# EAGLE board MotorBoard (EAGLE 6.4), part 1 of 2
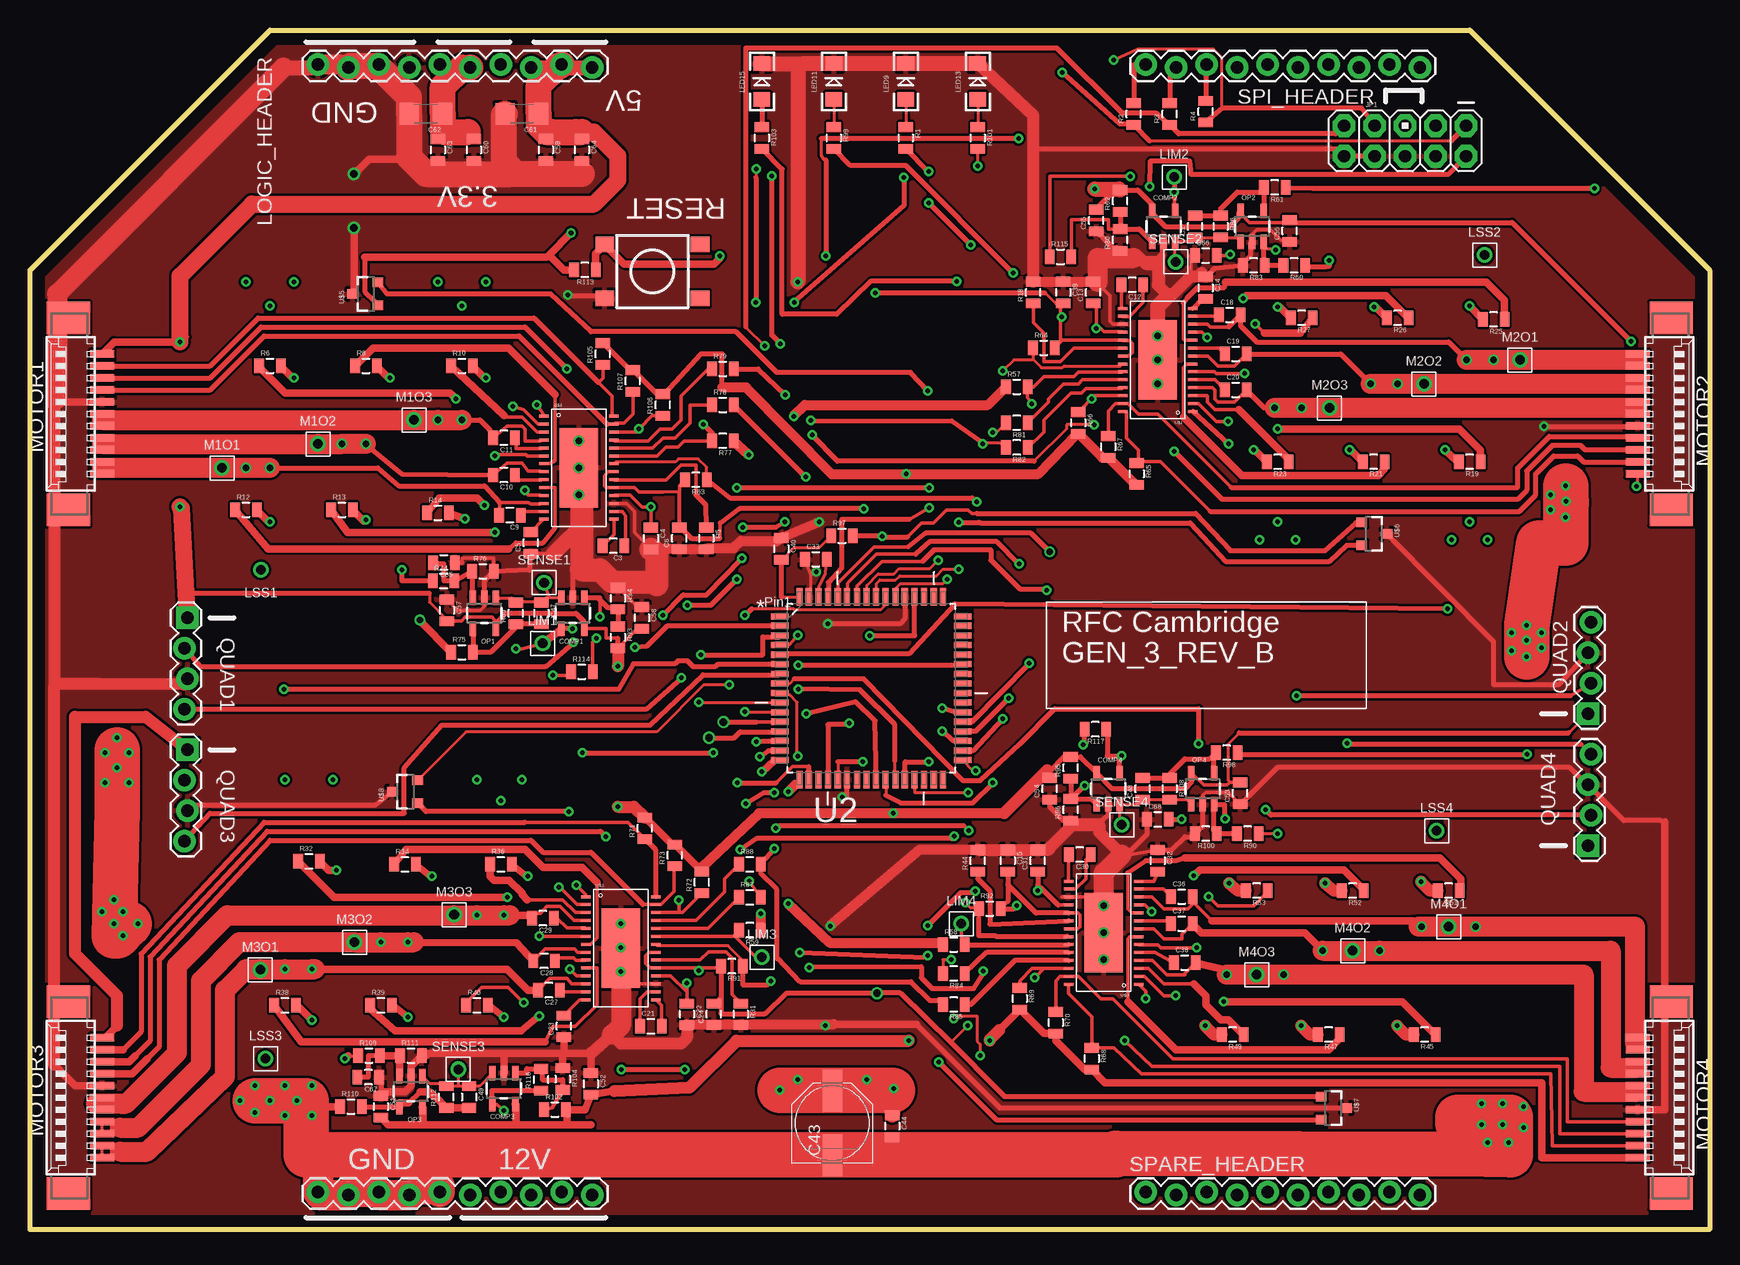
[diagram p2: board, top side]
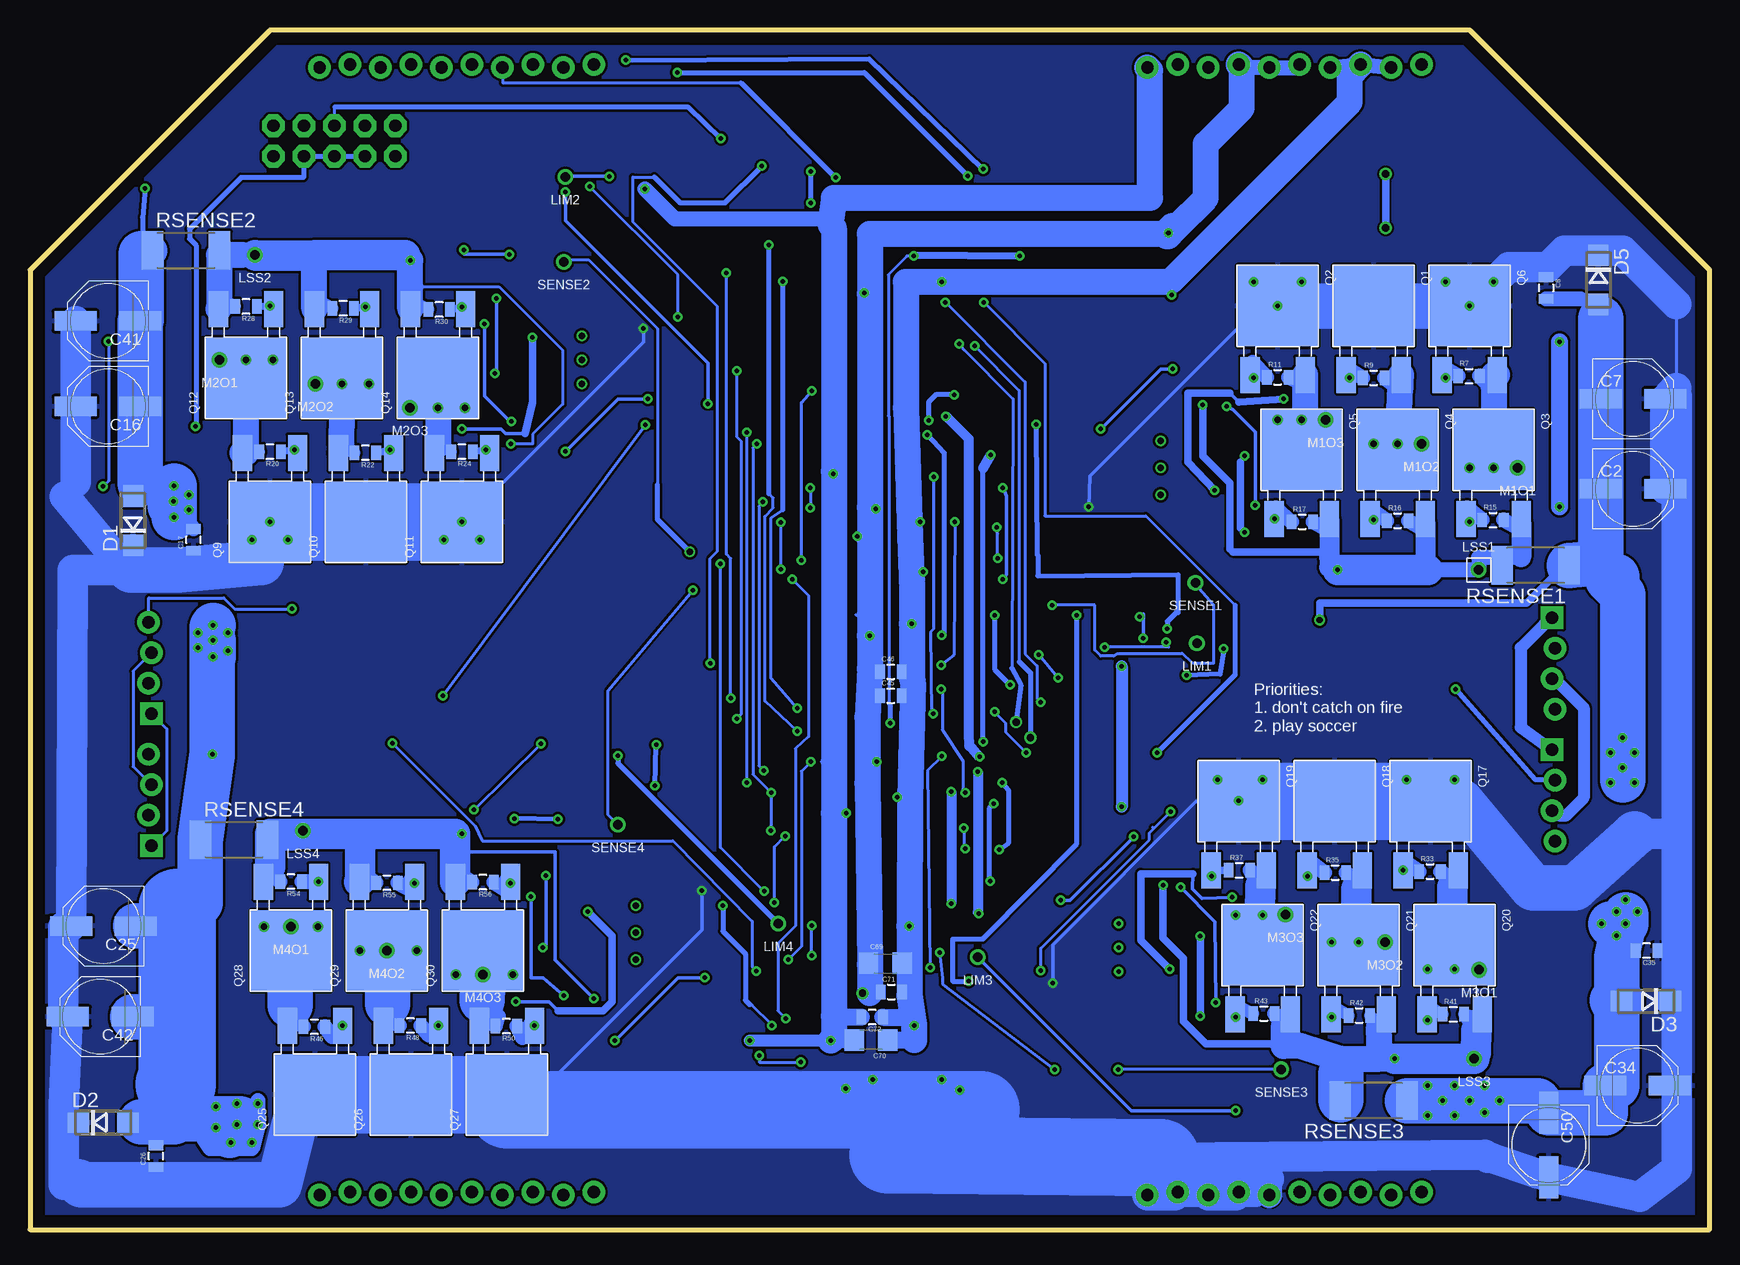
[diagram p3: board, bottom side, seen from below]

Size 140 x 100 mm. Coordinates in mm from the lower left corner, seen from the top.
Outline: 0,0 0,80 20,100 120,100 140,80 140,0 0,0
Copper layers (1*16): Top 0.035mm / dielectric 1.5mm / Bottom 0.035mm
Design rules "default *": minimum track width 10mil, minimum drill 15mil, track to track 8mil, track to pad 8mil, pad to pad 8mil, via to via 8mil, smd to smd 8mil, copper to edge 40mil, drill to drill 8mil, minimum pad ring 10mil, minimum via ring 8mil, stop-mask expansion 4mil, vias tented up to drill 0mil, thermal gap 10mil

## Footprints (pad centres in the part's own frame; a part is rotated, then mirrored left to right if it is on the bottom)
0805 = smd 0.8 x 1.2: 1 -0.9,0; 2 0.9,0
PANASONIC_D = smd 3.5 x 1.6: + 2.7,0; - -2.7,0
1206 = smd 1.6 x 1.8: 1 -1.4,0; 2 1.4,0
SOT23-5 = smd 0.55 x 1.2: 1 -0.95,-1.3; 2 0,-1.3; 3 0.95,-1.3; 4 0.95,1.3; 5 -0.95,1.3
DO214AC = smd 1.8 x 1.7: A 2.05,0; C -2.05,0
AVR_ICSP = drill 1.016 pad 1.88 octagon: 1 -1.27,5.08; 2 1.27,5.08; 3 -1.27,2.54; 4 1.27,2.54; 5 -1.27,0; 6 1.27,0; 7 -1.27,-2.54; 8 1.27,-2.54; 9 -1.27,-5.08; 10 1.27,-5.08
LED-1206 = smd 1.2 x 1.4: A -1.5,0; C 1.5,0
TESTING_PT = drill 0.8: P$1 0,0
1X10_LOCK = drill 1.016 pad 1.88: 1 0,0.127; 2 2.54,-0.127; 3 5.08,0.127; 4 7.62,-0.127; 5 10.16,0.127; 6 12.7,-0.127; 7 15.24,0.127; 8 17.78,-0.127; 9 20.32,0.127; 10 22.86,-0.127
GEN3CON = smd 0.61 x 2: 1 5,-2; 2 4,-2; 3 3,-2; 4 2,-2; 5 1,-2; 7 -1,-2; 8 -2,-2; 9 -3,-2; 10 -4,-2; 11 -5,-2 | smd 0.6 x 2: 6 0,-2 | smd 2.68 x 3.6: S1 8,0.8; S2 -8,0.8
DPAK = smd 6.7 x 6.7: DRAIN 0,0 | smd 3 x 1.6: GATE 5.75,-2.3; SOURCE 5.75,2.3
1X04_LOCK = drill 1.016 pad 1.88 square: 1 0,0.127 | drill 1.016 pad 1.88: 2 2.54,-0.127; 3 5.08,0.127; 4 7.62,-0.127
R2512 = smd 1.8 x 3.2: 1 -2.8,0; 2 2.8,0
TACTILE_SWITCH_TALL = smd 1.55 x 1.3: A1 -3.975,-2.25; A2 3.975,-2.25; B1 -3.975,2.25; B2 3.975,2.25
QFP80P1600X1600X120-64N = smd 1.473 x 0.508: 1 -7.62,5.994; 2 -7.62,5.207; 3 -7.62,4.394; 4 -7.62,3.607; 5 -7.62,2.794; 6 -7.62,2.007; 7 -7.62,1.194; 8 -7.62,0.406; 9 -7.62,-0.406; 10 -7.62,-1.194; 11 -7.62,-2.007; 12 -7.62,-2.794; 13 -7.62,-3.607; 14 -7.62,-4.394; 15 -7.62,-5.207; 16 -7.62,-5.994; 33 7.62,-5.994; 34 7.62,-5.207; 35 7.62,-4.394; 36 7.62,-3.607; 37 7.62,-2.794; 38 7.62,-2.007; 39 7.62,-1.194; 40 7.62,-0.406; 41 7.62,0.406; 42 7.62,1.194; 43 7.62,2.007; 44 7.62,2.794; 45 7.62,3.607; 46 7.62,4.394; 47 7.62,5.207; 48 7.62,5.994 | smd 0.508 x 1.473: 17 -5.994,-7.62; 18 -5.207,-7.62; 19 -4.394,-7.62; 20 -3.607,-7.62; 21 -2.794,-7.62; 22 -2.007,-7.62; 23 -1.194,-7.62; 24 -0.406,-7.62; 25 0.406,-7.62; 26 1.194,-7.62; 27 2.007,-7.62; 28 2.794,-7.62; 29 3.607,-7.62; 30 4.394,-7.62; 31 5.207,-7.62; 32 5.994,-7.62; 49 5.994,7.62; 50 5.207,7.62; 51 4.394,7.62; 52 3.607,7.62; 53 2.794,7.62; 54 2.007,7.62; 55 1.194,7.62; 56 0.406,7.62; 57 -0.406,7.62; 58 -1.194,7.62; 59 -2.007,7.62; 60 -2.794,7.62; 61 -3.607,7.62; 62 -4.394,7.62; 63 -5.207,7.62; 64 -5.994,7.62
TSSOP28-GROUNDPAD = smd 0.8 x 0.25: BRAKEN 2.921,2.317; CA -2.921,-3.627; CB -2.921,-0.985; CC -2.921,1.656; CP1 2.921,-3.627; CP2 2.921,-4.287; DIR 2.921,1.656; ENABLE 2.921,0.996; FAULT 2.921,0.335; GHA -2.921,-2.306; GHB -2.921,0.335; GHC -2.921,2.977; GLA -2.921,-1.646; GLB -2.921,0.996; GLC -2.921,3.637; GND 2.921,-2.967; HA 2.921,2.977; HB 2.921,3.637; HC 2.921,4.298; LSS -2.921,4.298; SA -2.921,-2.967; SB -2.927,-0.325; SC -2.921,2.317; SPEED 2.921,-1.646; TDEAD 2.921,-0.985; VBB 2.921,-2.306; VDD 2.927,-0.325; VREG -2.921,-4.287 | smd 3.2 x 6.6: PAD 0,0.005
SOT23-3 = smd 0.8 x 0.9: 1 -0.95,-1; 2 0.95,-1; 3 0,1.1

## Placement (x,y rotation side)
C1  4.7uF  [0805]  97.12,83.62 90 top
C2  100uF  [PANASONIC_D]  6.38,61.75 0 bottom
C3  .47uF  [0805]  48.62,57 180 top
C4  .1uF  [0805]  51.75,57.62 270 top
C5  1uF  [0805]  41.75,57.25 90 top
C6  .1uF  [0805]  54.12,57.62 90 top
C7  100uF  [PANASONIC_D]  6.38,69.25 0 bottom
C8  .1uF  [0805]  13.62,78.5 270 bottom
C9  .056uF  [0805]  40,59.55 180 top
C10  .056uF  [0805]  39.5,62.9 180 top
C11  .056uF  [0805]  39.5,66 180 top
C12  .47uF  [0805]  91.88,78.75 180 top
C13  .1uF  [0805]  88.62,78.12 90 top
C14  1uF  [0805]  98,78.5 270 top
C15  .1uF  [0805]  81.5,30.75 270 top
C16  100uF  [PANASONIC_D]  133.5,68.62 180 bottom
C17  .1uF  [0805]  126.38,57.5 90 bottom
C18  .056uF  [0805]  100,76.25 0 top
C19  .056uF  [0805]  100.5,73 0 top
C20  .056uF  [0805]  100.5,70 0 top
C21  .47uF  [0805]  51.75,16.95 0 top
C22  .1uF  [0805]  54.75,17.95 270 top
C23  1uF  [0805]  44.5,16.95 90 top
C24  .1uF  [0805]  57,17.95 90 top
C25  100uF  [PANASONIC_D]  133.88,25.3 180 bottom
C26  .1uF  [0805]  129.5,6.12 90 bottom
C27  .056uF  [0805]  43.25,19.95 180 top
C28  .056uF  [0805]  42.85,22.4 180 top
C29  .056uF  [0805]  42.75,25.95 180 top
C30  .47uF  [0805]  87.5,31.25 180 top
C31  .1uF  [0805]  84,30.75 90 top
C32  1uF  [0805]  94,30.75 270 top
C33  .1uF  [0805]  65.5,55.88 0 top
C34  100uF  [PANASONIC_D]  6,12 0 bottom
C35  .1uF  [0805]  5.25,23.25 180 bottom
C36  .056uF  [0805]  96,27.75 0 top
C37  .056uF  [0805]  96,25.5 0 top
C38  .056uF  [0805]  96.25,22.25 0 top
C39  .1uF  [0805]  86.12,78.12 270 top
C40  .1uF  [0805]  62.62,56.75 270 top
C41  100uF  [PANASONIC_D]  133.5,75.75 180 bottom
C42  100uF  [PANASONIC_D]  134.15,17.75 180 bottom
C43  100uF  [PANASONIC_D]  66.88,8.88 90 top
C44  .1uF  [0805]  71.88,8.62 270 top
C45  1uF  [0805]  68.25,44.5 0 bottom
C46  .01uF  [0805]  68.25,46.5 0 bottom
C47  4.7uF  [0805]  42.62,51.38 270 top
C48  4.7uF  [0805]  92.75,36.75 90 top
C49  4.7uF  [0805]  36.6,11.05 270 top
C50  100uF  [PANASONIC_D]  13.4,7.05 270 bottom
C51  .1uF  [0805]  29.25,10.25 270 top
C52  .1uF  [0805]  46.75,12.15 270 top
C53  .1uF  [0805]  100.88,36.38 90 top
C54  .1uF  [0805]  85,36.75 90 top
C55  .1uF  [0805]  88.88,84.12 90 top
C56  .1uF  [0805]  105,83.25 90 top
C57  .1uF  [0805]  34.75,51.62 270 top
C58  .1uF  [0805]  51,51 270 top
C59  1uF  [0805]  43,90 270 top
C60  .01uF  [0805]  37,90 270 top
C61  47uF  [1206]  41,93 180 top
C62  47uF  [1206]  33,93 180 top
C63  1uF  [0805]  34,90 270 top
C64  .01uF  [0805]  46,90 270 top
C65  4.7uF  [0805]  34.5,55.6 180 top
C66  4.7uF  [0805]  98,81.2 0 top
C67  4.7uF  [0805]  28.2,12.7 180 top
C68  4.7uF  [0805]  94,34.2 0 top
C69  47uF  [1206]  68.7,22.2 0 bottom
C70  47uF  [1206]  69.9,15.8 180 bottom
C71  .1uF  [0805]  68.2,19.8 0 bottom
C72  .1uF  [0805]  69.8,17.7 180 bottom
COMP1  LM331  [SOT23-5]  45.25,51.38 180 top
COMP2  LM331  [SOT23-5]  94.5,83.62 0 top
COMP3  LM331  [SOT23-5]  39.5,11.75 180 top
COMP4  LM331  [SOT23-5]  89.88,36.75 0 top
D1  DIODE-ZENERDO214AC  [DO214AC]  131.4,59.1 90 bottom
D2  DIODE-ZENERDO214AC  [DO214AC]  133.9,8.9 0 bottom
D3  DIODE-ZENERDO214AC  [DO214AC]  5.3,19.05 180 bottom
D5  DIODE-ZENERDO214AC  [DO214AC]  9.28,79.17 270 bottom
FRAME1  FRAME-LETTER  [CREATIVE_COMMONS]  -77.47,27.94 0 top  (outside the outline)
FRAME2  FRAME-LETTER  [CREATIVE_COMMONS]  -77.47,36.83 0 top  (outside the outline)
FRAME5  FRAME-LETTER  [CREATIVE_COMMONS]  -77.47,45.72 0 top  (outside the outline)
FRAME6  FRAME-LETTER  [CREATIVE_COMMONS]  -77.47,54.61 0 top  (outside the outline)
FRAME7  FRAME-LETTER  [CREATIVE_COMMONS]  -28.42,18.51 0 bottom  (outside the outline)
GEN_3_REV_B  Spring 2015  [LOGO]  86,44.7 0 top
JP1  M05X2PTH  [AVR_ICSP]  114.62,90.75 270 top
LED9  [LED-1206]  73,95.7 90 top
LED11  [LED-1206]  67,95.7 90 top
LED13  [LED-1206]  79,95.7 90 top
LED15  [LED-1206]  61,95.7 90 top
LIM1  TEST_PT  [TESTING_PT]  42.73,48.88 0 top
LIM2  TEST_PT  [TESTING_PT]  95.38,87.75 0 top
LIM3  TEST_PT  [TESTING_PT]  61,22.7 0 top
LIM4  TEST_PT  [TESTING_PT]  77.62,25.5 0 top
LOGIC_HEADER  M10LOCK  [1X10_LOCK]  24,97 0 top
LSS1  TEST_PT  [TESTING_PT]  19.25,55 0 bottom
LSS2  TEST_PT  [TESTING_PT]  121.25,81.25 0 top
LSS3  TEST_PT  [TESTING_PT]  19.62,14.25 0 top
LSS4  TEST_PT  [TESTING_PT]  117.25,33.25 0 top
M1O1  TEST_PT  [TESTING_PT]  16,63.5 0 top
M1O2  TEST_PT  [TESTING_PT]  24,65.5 0 top
M1O3  TEST_PT  [TESTING_PT]  32,67.5 0 top
M2O1  TEST_PT  [TESTING_PT]  124.21,72.5 0 top
M2O2  TEST_PT  [TESTING_PT]  116.2,70.5 0 top
M2O3  TEST_PT  [TESTING_PT]  108.33,68.5 0 top
M3O1  TEST_PT  [TESTING_PT]  19.2,21.65 0 top
M3O2  TEST_PT  [TESTING_PT]  27.05,23.95 0 top
M3O3  TEST_PT  [TESTING_PT]  35.35,26.25 0 top
M4O1  TEST_PT  [TESTING_PT]  118.25,25.25 0 top
M4O2  TEST_PT  [TESTING_PT]  110.25,23.25 0 top
M4O3  TEST_PT  [TESTING_PT]  102.25,21.25 0 top
MOTOR1  MOTORCON  [GEN3CON]  4,68 90 top
MOTOR2  MOTORCON  [GEN3CON]  136,68 270 top
MOTOR3  MOTORCON  [GEN3CON]  4,11 90 top
MOTOR4  MOTORCON  [GEN3CON]  136,11 270 top
OP1  MCP6291T-E/OT  [SOT23-5]  37.88,51.38 180 top
OP2  MCP6291T-E/OT  [SOT23-5]  101.88,83.62 0 top
OP3  MCP6291T-E/OT  [SOT23-5]  31.75,11.5 180 top
OP4  MCP6291T-E/OT  [SOT23-5]  97.75,36.75 0 top
POWER_HEADER  M10LOCK  [1X10_LOCK]  24,3 0 top
Q1  [DPAK]  28,77 270 bottom
Q2  [DPAK]  36,77 270 bottom
Q3  [DPAK]  18,65 270 bottom
Q4  [DPAK]  26,65 270 bottom
Q5  [DPAK]  34,65 270 bottom
Q6  [DPAK]  20,77 270 bottom
Q9  [DPAK]  120,59 90 bottom
Q10  [DPAK]  112,59 90 bottom
Q11  [DPAK]  104,59 90 bottom
Q12  [DPAK]  122,71 90 bottom
Q13  [DPAK]  114,71 90 bottom
Q14  [DPAK]  106,71 90 bottom
Q17  [DPAK]  23.25,35.7 270 bottom
Q18  [DPAK]  31.25,35.7 270 bottom
Q19  [DPAK]  39.25,35.7 270 bottom
Q20  [DPAK]  21.25,23.7 270 bottom
Q21  [DPAK]  29.25,23.7 270 bottom
Q22  [DPAK]  37.25,23.7 270 bottom
Q25  [DPAK]  116.25,11.25 90 bottom
Q26  [DPAK]  108.25,11.25 90 bottom
Q27  [DPAK]  100.25,11.25 90 bottom
Q28  [DPAK]  118.25,23.25 90 bottom
Q29  [DPAK]  110.25,23.25 90 bottom
Q30  [DPAK]  102.25,23.25 90 bottom
QUAD1  [1X04_LOCK]  13,51 270 top
QUAD2  [1X04_LOCK]  130,43 90 top
QUAD3  [1X04_LOCK]  13,40 270 top
QUAD4  [1X04_LOCK]  130,32 90 top
R1  1k  [0805]  73,91 270 top
R2  4.7k  [0805]  92,93 90 top
R3  4.7k  [0805]  95,93 90 top
R4  4.7k  [0805]  98,93.2 90 top
R5  40.2k  [0805]  56.38,57.62 270 top
R6  47.5  [0805]  20,72 0 top
R7  470k  [0805]  20.05,71.15 0 bottom
R8  47.5  [0805]  28,72 0 top
R9  470k  [0805]  28,71 0 bottom
R10  47.5  [0805]  36,72 0 top
R11  470k  [0805]  36,71.05 0 bottom
R12  47.5  [0805]  18,60 0 top
R13  47.5  [0805]  26,60 0 top
R14  47.5  [0805]  34,59.75 0 top
R15  470k  [0805]  18.05,59.15 0 bottom
R16  470k  [0805]  26,59.1 0 bottom
R17  470k  [0805]  33.95,59 0 bottom
R18  40.2k  [0805]  83.62,78.12 90 top
R19  47.5  [0805]  120,64 180 top
R20  470k  [0805]  120,64.85 180 bottom
R21  47.5  [0805]  112,64 180 top
R22  470k  [0805]  112.05,64.75 180 bottom
R23  47.5  [0805]  104,64 180 top
R24  470k  [0805]  104,64.85 180 bottom
R25  47.5  [0805]  122,75.88 180 top
R26  47.5  [0805]  114,76 180 top
R27  47.5  [0805]  106,76 180 top
R28  470k  [0805]  122,76.95 180 bottom
R29  470k  [0805]  113.9,76.8 180 bottom
R30  470k  [0805]  105.9,76.7 180 bottom
R31  40.2k  [0805]  59.25,17.95 270 top
R32  47.5  [0805]  23.25,30.7 0 top
R33  470k  [0805]  23.3,29.85 0 bottom
R34  47.5  [0805]  31.25,30.45 0 top
R35  470k  [0805]  31.2,29.75 0 bottom
R36  47.5  [0805]  39.25,30.45 0 top
R37  470k  [0805]  39.2,29.95 0 bottom
R38  47.5  [0805]  21.25,18.7 0 top
R39  47.5  [0805]  29.25,18.7 0 top
R40  47.5  [0805]  37.25,18.7 0 top
R41  470k  [0805]  21.35,17.95 0 bottom
R42  470k  [0805]  29.2,17.85 0 bottom
R43  470k  [0805]  37.15,18 0 bottom
R44  40.2k  [0805]  79,30.75 90 top
R45  47.5  [0805]  116.25,16.25 180 top
R46  470k  [0805]  116.3,16.9 180 bottom
R47  47.5  [0805]  108.25,16.25 180 top
R48  470k  [0805]  108.3,17 180 bottom
R49  47.5  [0805]  100.25,16.25 180 top
R50  470k  [0805]  100.3,16.95 180 bottom
R51  47.5  [0805]  118.25,28.25 180 top
R52  47.5  [0805]  110.25,28.25 180 top
R53  47.5  [0805]  102.25,28.25 180 top
R54  470k  [0805]  118.25,29 180 bottom
R55  470k  [0805]  110.25,28.9 180 bottom
R56  470k  [0805]  102.25,28.95 180 bottom
R57  3k  [0805]  82.25,70.25 0 top
R58  3k  [0805]  77,23.75 0 top
R59  3k  [0805]  60,24.95 180 top
R60  2k  [0805]  105.38,80.38 180 top
R61  2k  [0805]  103.75,86.88 180 top
R62  66.5k  [0805]  90.88,85.75 90 top
R63  1k  [0805]  55.5,62.5 180 top
R64  1k  [0805]  84.5,73.5 0 top
R65  10k  [0805]  92.25,63 270 top
R66  10k  [0805]  87.38,67.25 270 top
R67  10k  [0805]  89.88,65.25 270 top
R68  10k  [0805]  88.5,14.25 270 top
R69  10k  [0805]  82.5,19.25 270 top
R70  10k  [0805]  85.5,17.25 270 top
R71  10k  [0805]  51.25,33.45 90 top
R72  10k  [0805]  56,28.95 90 top
R73  10k  [0805]  53.75,31.2 90 top
R74  2k  [0805]  34.48,54.08 0 top
R75  2k  [0805]  36,48.12 0 top
R76  30k  [0805]  37.75,54.88 0 top
R77  3k  [0805]  57.75,65.75 180 top
R78  1k  [0805]  57.75,68.75 0 top
R79  1k  [0805]  57.75,71.75 0 top
R80  37.5k  [0805]  90.88,82.5 90 top
R81  1k  [0805]  82.25,67.25 180 top
R82  1k  [0805]  82.25,65.2 180 top
R83  30k  [0805]  102,80.38 180 top
R84  1k  [0805]  77,21.35 180 top
R85  1k  [0805]  77,18.75 180 top
R86  30k  [0805]  99.25,83.62 270 top
R87  1k  [0805]  60,27.7 0 top
R88  1k  [0805]  60,30.45 0 top
R89  30k  [0805]  40.5,51.38 90 top
R90  2k  [0805]  101.5,33 180 top
R91  1k  [0805]  58.5,21.95 180 top
R92  1k  [0805]  80,26.75 0 top
R93  66.5k  [0805]  49,49.38 270 top
R94  37.5k  [0805]  49,52.62 270 top
R95  66.5k  [0805]  86.75,38.5 90 top
R96  37.5k  [0805]  86.75,35 90 top
R97  10k  [0805]  67.69,57.84 0 top
R98  2k  [0805]  99.75,39.75 180 top
R99  1k  [0805]  67,91 270 top
R100  30k  [0805]  98,33 180 top
R101  1k  [0805]  79,91 270 top
R102  66.5k  [0805]  43.75,10 0 top
R103  1k  [0805]  61,91 270 top
R104  37.5k  [0805]  44.4,12.55 270 top
R105  10k  [0805]  47.75,73 90 top
R106  10k  [0805]  52.75,68.75 90 top
R107  10k  [0805]  50.25,70.75 90 top
R108  30k  [0805]  95,36.75 270 top
R109  2k  [0805]  28.25,14.5 0 top
R110  2k  [0805]  26.75,10.25 0 top
R111  30k  [0805]  31.75,14.5 0 top
R112  30k  [0805]  34.7,11.05 90 top
R113  10k  [0805]  46.25,80 180 top
R114  1M  [0805]  46,46.5 0 top
R115  1M  [0805]  85.9,81.1 0 top
R116  1M  [0805]  42.6,12.5 90 top
R117  1M  [0805]  88.8,41.7 180 top
RSENSE1  .02  [R2512]  14.5,55.38 180 bottom
RSENSE2  .02  [R2512]  127,81.62 0 bottom
RSENSE3  .02  [R2512]  28,10.75 180 bottom
RSENSE4  .02  [R2512]  123,32.5 0 bottom
S1  SWITCH-MOMENTARY-2SMD-4  [TACTILE_SWITCH_TALL]  51.88,79.88 180 top
SENSE1  TEST_PT  [TESTING_PT]  42.85,53.92 0 top
SENSE2  TEST_PT  [TESTING_PT]  95.5,80.67 0 top
SENSE3  TEST_PT  [TESTING_PT]  35.7,13.35 0 top
SENSE4  TEST_PT  [TESTING_PT]  91,33.75 0 top
SPARE_HEADER  M10LOCK  [1X10_LOCK]  93,3 0 top
SPI_HEADER  M10LOCK  [1X10_LOCK]  93,97 0 top
U2  ATMEGA165PV-8AU  [QFP80P1600X1600X120-64N]  70.12,45.12 0 top
U$1  A4915  [TSSOP28-GROUNDPAD]  94,72.5 180 top
U$2  A4915  [TSSOP28-GROUNDPAD]  49.25,23.45 0 top
U$3  A4915  [TSSOP28-GROUNDPAD]  89.5,24.75 180 top
U$4  A4915  [TSSOP28-GROUNDPAD]  45.75,63.5 0 top
U$5  MCP9700SMD  [SOT23-3]  28,78 90 top
U$6  MCP9700SMD  [SOT23-3]  112,58 270 top
U$7  MCP9700SMD  [SOT23-3]  108.62,10.12 270 top
U$8  MCP9700SMD  [SOT23-3]  31.3,36.5 90 top

## Tracks (layer width: path | path; a pad name or v marks a point on that pad's centre or on a via)
3.3V  (via drill 0.38, 0.38 pad 0.51, 0.6)
  Top 0.254: 119.7,89.45 JP1.2 | v86,76.1 85.88,76.1 | 28.8,77.25 U$5.1 28.75,77.35 | v55.75,21.6 55.75,21.8 | 67.35,39 67.35,37.55 U2.21 | 73.7,52.7 U2.52 | 57.55,58.9 57.52,58.75 | 76.76,15.61 v78.15,17 | 84.6,78.1 85.75,76.95 C39.2 | 68.9,57.8 68.6,57.8 R97.2 | 71.15,57.75 v71.05,57.8
  Top 0.305: 54.1,61.52 C6.2 54.12,62.02 R63.2 | 54.1,61.52 52.75,61.5 50.75,61.5 50.4,61.85 U$4.SPEED 48.65,61.88 48,61.88 47.88,62 47.88,62.88 48.17,63.17 U$4.VDD | 54.1,61.52 54.1,58.65 | 57.5,57.62 57.52,58.75 | C39.2 86.12,77.12 85.88,76.88 85.88,76.1 85.88,73.97 | 85.88,73.97 R64.2 | 85.88,73.97 86.05,74.15 U$1.SPEED 91.1,74.12 91.62,74.12 91.88,73.88 91.88,73.12 91.58,72.83 U$1.VDD | U$2.VDD 52.15,23.1 51.6,23.1 51.3,22.8 51.3,22.2 51.7,21.8 U$2.SPEED 55.75,21.8 57.45,21.8 R91.2 57.6,19.45 C24.2 | U$3.SPEED 87.35,26.4 87.5,26.25 87.5,25.25 87.33,25.07 U$3.VDD | 81.5,27.35 R92.2 | 73.15,57.75 74.3,58.9 75.3,58.9 76.4,60 78.2,60 78.5,59.7 78.9,59.7
  Top 0.406: 54.1,58.65 55.12,57.62 57.5,57.62 | C15.2 81.5,28.75 | 81.5,28.75 83.85,26.4 U$3.SPEED | 81.5,28.75 81.5,27.35 | U$7.1 81.25,11.07 78.75,13.57 78.75,13.62 76.76,15.61 72.55,19.73 70.62,19.73 | R91.2 57.6,18.02 57.62,18 61.25,18 63.08,19.73 70.62,19.73 | R92.2 82,26.75 v82.25,27 | 119.7,89.45 118.25,88 96.75,88 96.65,89.1 93.4,89.1 v93.35,86.95 | U$8.1 33,34.85 v44.9,34.85 | v69.4,39 67.35,39 | 57.55,58.9 59.15,60.1 v69.5,60.1 | v70.45,78.1 84.6,78.1 | 73.7,52.7 73.7,49.55 73.75,49.5 v70,49.5 | 28.75,77.35 27.9,78.2 27.9,81.05 | v71.05,57.8 68.9,57.8 | 78.9,59.7 97.15,59.7 100.05,56.6 107.95,56.6 110.5,58.9 110.95,58.9 U$6.1 | 71.15,57.75 73.15,57.75 | 70.62,19.73 v70.6,19.7
  Top 0.609: 27.9,81.05 43.06,81.05 43.26,81.25 v45.1,83.09
  Top 0.61: R113.2 44.5,80 43.26,81.25
  Top 0.813: C63.1 34,91 34.5,91.5 | C60.1 37,91 36.5,91.5
  Top 2.184: LOGIC_HEADER.6 36,96.87 34.4,95.27 C62.1 34.4,91.6 34.5,91.5 36.5,91.5
  Bottom 0.254: v93.35,86.95 86,79.6 v86,76.1 | 46.33,33.42 46.7,33.05 46.7,32.5 55.75,23.45 v55.75,21.6 | 46.33,33.42 v44.9,34.85 | v71.05,57.8 70,57.5 | 46.4,33.55 46.4,33.5 46.33,33.42 | v69.4,39 70.2,37.2 | 71.15,51.25 70,51.25 | v69.5,60.1 70,60.2 | v78.15,17 78.15,17.05 79.8,18.7 80,18.75 | v70.45,78.1 70,78
  Bottom 0.406: v82.25,27 82.25,24.88 80.38,23 80.38,19.12 80,18.75 | C46.1 70,46.75 | C45.1 70.2,42.7 | C69.1 70,22.2 70,22.1 | C71.1 70,19.8 70.1,19.7 v70.6,19.7
  Bottom 0.609: v45.1,83.09 45.08,83.09 44.71,83.46
  Bottom 1.27: LOGIC_HEADER.7 39.24,96.87 LOGIC_HEADER.6 34.16,96.87 LOGIC_HEADER.5
  Bottom 2.184: 45.21,83 70,83 70,78 70,60.2 70,57.5 70,51.25 v70,49.5 70,46.75 70.2,42.7 70.2,37.2 70,22.1 70,19.8 70,19.7 | 44.71,83.46 44.54,83.46 42,86 42,90.5 39,93.5 39,96.89 LOGIC_HEADER.7
  Bottom 2.54: 44.71,83.46 v45.1,83.09 45.21,83
5V  (via drill 0.38, 0.38 pad 0.51)
  Top 0.254: MOTOR2.1 134,61.95 v133.9,61.95 | 105,83.95 C56.2 | 34.7,50.85 C57.2 34.65,50.95 33.3,52.3 33.3,53.05 | 13.01,53.06 13.7,53.1 13.8,53.05 | 84.8,38.3 85,38.25 | 87.25,66.3 R66.2 | 56,30.25 R72.2 | 52.9,69.7 R106.2 | 74.75,62.95 v73.05,63 | 128.25,41.4 129.85,43 QUAD2.1 | 100.8,41.4 99.9,40.5 99.9,37.4 99.95,37.4 100.03,37.27 | 13.15,74.4 12.5,74.13 | 88.8,84.85 C55.2
  Top 0.305: R106.2 52.25,69.65 | R107.2 50,71.65 | C57.2 35.98,50.73 36.25,51.05 38.5,51.05 38.88,50.62 | C58.2 50.62,50.1 R93.2 | OP2.5 100.92,84.7 101.62,83.95 104.85,83.95 C56.2 | R67.2 89.38,64.35 | R65.2 92.12,62.1 | R68.2 87.9,13.35 | C53.2 100.03,37.27 99.75,37.05 97.85,37.05 OP4.5 | 49,49.3 48,49.3 48,50.1 46.2,50.1
  Top 0.406: 52.25,69.65 R107.2 | 50,71.65 R105.2 | 43.62,51.38 45.5,51.38 46.12,50.75 46.12,50.15 COMP1.5 46.2,50.1 | 43.62,51.38 | 43.62,51.38 39.62,51.38 38.88,50.62 38.88,50.12 OP1.5 | OP2.5 100.75,84.75 100.75,84.38 100,83.62 94.62,83.62 93.55,84.7 COMP2.5 93.5,84.97 93.5,85.5 92.35,86.65 R62.2 90.6,86.38 90.12,86.38 88.88,85.12 C55.2 | OP4.5 96.8,37.3 96.25,36.75 90.22,36.75 COMP4.5 87.58,39.4 R95.2 86.15,39.4 85,38.25 C54.2 | v133.45,74.05 123.55,83.95 105,83.95 | 52.9,69.7 55.9,73 57.7,73 57.7,70.2 | 100.8,41.4 128.25,41.4 | 13.8,53.05 33.3,53.05 | R93.2 49,49.3
  Top 0.61: C51.2 29.85,8.75 32.75,8.75 | 32.75,8.75 40.5,8.75 | 40.5,8.75 44.75,8.75 | 44.75,8.75 46.75,8.75 | 44.75,8.75 44.75,9.9 R102.2 46.25,10 C52.2 48.7,11.55 | COMP3.5 40.5,10.4 40.5,8.75 | OP3.5 32.75,10.15 32.75,8.75 | MOTOR3.1 6.25,16 7.25,17 | R72.2 R73.2 53.5,32.1 R71.2 | 87.9,13.35 85.5,15.75 R70.2 84.5,16.35 R69.2 80.78,16.62 | MOTOR4.1 126,6 126,12.25 89.6,12.25 R68.2 | MOTOR1.1 7,74 v12.5,74
  Top 0.813: 89.38,64.35 R66.2 | 92.12,62.1 R67.2 | 87.25,66.3 84.05,63 v73.05,63 | 56,30.25 60.75,34.7 v71.95,34.7 81.2,34.7 | 57.7,70.2 59.7,70.2 66.85,62.95 74.75,62.95 | C59.1 43,91 43.5,91.5 | C64.1 46,91.5
  Top 1.016: 7.25,17 7.25,19.5 3.75,23 3.75,42.75 9.63,42.75 QUAD3.1 | 13.38,51.25 QUAD1.1 | 48.7,11.55 54.98,11.85 58.88,15.75 v73.25,15.75 | v80,15.75 80,15.85 80.78,16.62 | R93.2 v49,46.95 | v49,35.25 50.35,35.25 R71.2 | 84.8,38.3 81.2,34.7
  Top 1.27: v88.75,86.75 90.78,86.75 R62.2 | LOGIC_HEADER.8 44.4,96.87 | 44.4,96.87 LOGIC_HEADER.10 | LOGIC_HEADER.9 44.4,97.13 44.4,96.87
  Top 1.422: QUAD1.1 13.01,53.06 12.63,60.12 v12.5,60.25 | 12.5,74.13 v12.5,74 12.5,79.5 18.5,85.5 47,85.5 49,87.5 49,89.5 47,91.5 45.5,91.5
  Top 2.184: LOGIC_HEADER.9 44.19,97 44,97 42.4,95.4 C61.1 42.4,92.1 43,91.5 43.5,91.5 45.5,91.5 46,91.5
  Bottom 0.254: v133.9,61.95 133.45,62.4 v133.45,74.05 | QUAD4.1 129.85,32 128.6,33.25 128.6,41.75 129.85,43 QUAD2.1 | 74.05,39 73,39 | v73.05,63 73,63.2 | v71.95,34.7 73,34.7
  Bottom 1.016: QUAD1.1 13.75,50.5 15.75,48.5 15.75,41.87 QUAD3.1 | v73.25,15.75 v80,15.75 | v49,46.95 v49,35.25
  Bottom 1.27: 73.25,84.25 86.25,84.25 v88.75,86.75
  Bottom 1.422: v12.5,60.25 v12.5,74 | C72.2 72.9,17.7 73,17.8 | C70.2 73.2,15.8 v73.25,15.75
  Bottom 2.184: v73.25,15.75 73,16 73,17.8 73,34.7 73,39 73,63.2 73,83.5 73.25,83.75 73.25,84.25 73,86 46.63,86 46.63,96.64 LOGIC_HEADER.10
12V  (via drill 0.38, 0.38 pad 0.51)
  Top 0.254: v64,12.5 64,11.62 | v69.75,12.5 69.75,11.62 | v72,11.75 70.62,11.62
  Top 0.305: U$4.VBB 48.73,61.25 50,61.25 51,60.25 v51.75,60.25 C4.1 | C13.1 88.88,76.97 v88.88,75.12 89.25,75.12 89.5,74.88 91.01,74.88 U$1.VBB | U$2.VBB 53.41,21.14 54.75,19.8 C22.1 v54.75,20.55 | 84,28.75 84.25,28.5 v84,28.25 | U$3.VBB 85.69,27.06
  Top 0.406: C31.1 84,28.75 | 85.69,27.06 84.25,28.5
  Top 1.27: 71.88,11.62 C44.1 | 69.75,11.62 66.88,11.62 C43.+
  Top 3.81: v62.5,11.62 64,11.62 69.75,11.62 70.62,11.62 71.88,11.62
  Bottom 0.254: v22,79 22,78.9 Q6.DRAIN | v37.25,37.5 Q19.DRAIN v41,37.5 | v118.5,57.5 Q9.DRAIN v121.5,57.5 | 2.76,77.14 2.75,75.9 2.75,71.4 2.76,70.16
  Bottom 0.305: v51.75,60.25 51.65,62.83 37.41,77.06 | 37.41,77.06 37,77.12 36.12,77.12 Q2.DRAIN | Q11.DRAIN 103.88,59 88.88,74 v88.88,75.12 | C17.1 126.65,56.6 127.62,55 | v54.75,20.55 54.75,23.75 42.8,35.7 Q19.DRAIN | v84,28.25 84,25 98,11 100,11 Q27.DRAIN | v34,79 34,78.1 35.1,77 | v38,79 38,77.1 37.41,77.06
  Bottom 0.406: C8.1 13.62,80.12 13.75,80.25 | v21.25,37.5 21.25,35.7 | v25.25,37.5 24.5,37.5 24.25,37.25 24.25,35.95 24,35.7 | D5.C 7.38,81.22 7.11,81.49 | D1.C 131.4,56.27 132.3,55.36 | 136.2,62.3 136.2,62.02 137.11,61.11 | D2.C 136.7,8.9 137.2,8.4 | 38.5,35.75 v39.25,35.75 Q19.DRAIN
  Bottom 0.61: C35.1 3.25,23.25 2.75,22.75
  Bottom 0.813: 123.75,4.5 124.12,4.5 129.5,4.5 C26.1
  Bottom 1.27: v105.5,57.5 Q11.DRAIN v102.5,57.5
  Bottom 1.422: 119.25,3.75 124.12,3.75 124.12,4.5 | 61.38,10 v62.5,11.62
  Bottom 1.676: C34.+ 3.25,12 2.75,11.5
  Bottom 2.184: 36.75,4.25 36.75,2.92 POWER_HEADER.6 | 136,4 137.2,4
  Bottom 2.54: C2.+ C7.+ 3.09,69.84 | 2.76,70.16 3.09,69.84 | 2.76,77.14 7.11,81.49 7.25,81.62 12.12,81.62 13.5,80.25 13.75,80.25 16.75,80.25 v18,79 Q6.DRAIN | C41.+ C16.+ 136.2,62.3 | 137.11,61.11 132.3,55.36 132,55 | 132,55 131.62,55 | 120.75,55.62 120.5,55.88 120.5,58.5 Q9.DRAIN | D3.C 2.75,19.11 | 2.75,19.11 2.75,22.75 2.75,33 | 2.75,33 2.75,69.5 3.09,69.5 3.09,69.84 | 2.75,19.11 2.75,11.5 2.75,5.05 5.8,2.75 C50.+ 14.4,4.7 18.25,6 18.5,6 18.75,6.25 45.75,6 39.24,4.74 POWER_HEADER.7 | POWER_HEADER.10 44.57,2.87 POWER_HEADER.9 42.03,3.13 POWER_HEADER.8 39.49,2.87 POWER_HEADER.7 | POWER_HEADER.7 37.87,3.13 36.75,4.25 | 6.25,33 2.75,33 | 137.25,17.75 C42.+ 137.2,10.39 137.2,8.4 137.2,4 137.2,3.75 | 137.25,17.75 137.32,17.75 | 137.25,17.75 137.25,25.25 C25.+ 136.45,55 132,55
  Bottom 3.81: Q2.DRAIN 35.1,77 Q1.DRAIN Q6.DRAIN | 131.62,55 127.62,55 120.75,55.62 | Q17.DRAIN 21.25,35.7 20.75,35.7 14.75,28.5 11.25,28.5 6.25,33 | 100.25,10 Q27.DRAIN | Q25.DRAIN 116.25,9.75 117.75,9.75 119.25,3.75 135.75,3.75 136,4 | 60.75,10 68.5,6.25
  Bottom 6.452: Q9.DRAIN Q10.DRAIN Q11.DRAIN | Q17.DRAIN 24,35.7 Q18.DRAIN Q19.DRAIN | Q25.DRAIN Q26.DRAIN Q27.DRAIN | 100.25,10 61.38,10 60.75,10 | 68.5,6.25 45.75,6
  other vias: 20,77 36,77 104,59 120,59
  pour Bottom: 21,99 1,79 1,1 139,1 139,79 119,99
12VGND  (via drill 0.38, 0.38 pad 0.51, 0.51 pad 0.51)
  Top 0.254: C44.2 71.88,6.25 72.75,6.25 | v7.75,24.5 7.5,24.75 | 7.97,25.23 7.65,25.55 7.5,26.25 | v121.5,7.25 121.5,6.26 | v122.75,8.75 123.38,8.75 | v122.75,10.5 123.38,9.38 v124.5,10.25 | v123.25,7.25 123.25,6.25 | v124.5,8.5 123.38,8.5
  Top 0.305: v123.5,49.75 124.65,49.75 124.75,49.65 | v126,48.5 125.38,48.5 v124.75,49.12 | v123.5,48.25 124.25,48.25 v124.75,47.75
  Top 0.406: R61.1 106.92,86.8 v130.4,86.8 | R98.1 100.78,39.62 v124.8,39.62 | v7,27.5 6.5,27.5 6.5,26 6,26 | 6,26 6,25.75 | 6,26 v6,26.5 | v9,25.5 8.25,25.5 | v6.25,37.25 7.25,37.25 v8.25,37.25 | v8.25,39.75 7.25,39.75 v6.25,39.75 | v18.75,12 18.75,10.75 v18.75,9.75 | v21.25,12 21.25,10.75 v21.25,9.5 | v23.5,12 23.5,10.75 | v23.5,9.5 23.5,9.75 24,10.25 | 32.5,50.73 v32.5,50.8
  Top 0.61: R110.1 24,10.25 23.5,10.75 23,10.75 | 32.5,50.73 R75.1
  Top 1.27: v121,8.75 121.75,9.38 | 128,60 v126.75,60 v126.75,61.25
  Top 1.422: v6,26.5 6.75,26.5 7,26.25 7.5,26.25 v7.75,26.5
  Top 1.676: C43.- 66.88,6.25 70.88,6.25
  Top 2.184: POWER_HEADER.5 31.87,3.13 POWER_HEADER.4
  Top 2.54: POWER_HEADER.4 29.33,2.87 POWER_HEADER.3 26.79,3.13 POWER_HEADER.2 24.25,2.87 POWER_HEADER.1 24,6 | POWER_HEADER.5 34.16,3.59 33.5,4.25
  Top 3.81: 24,6 23,6.25 | 23,6.25 70.88,6.25 72.75,6.25 90.5,6.25 90.5,6.38 121.5,6.26 123.25,6.25 123.38,6.25 123.38,8.5 123.38,8.75 123.38,9.38 121.75,9.38 119,9.38 119,8.88 | 23,6.25 23,10.75 v22.25,10.75 21.25,10.75 v20,10.75 18.75,10.75 | 7.25,40 7.25,39.75 v7.25,38.5 7.25,37.25 7.25,35 7,24.5 7.25,24.5 7.5,24.75 7.97,25.23 8.25,25.5 | v124.75,47.75 v124.75,49.12 124.75,49.65 v124.75,50.38 125.75,57.25 128,57.25 v128,59.38 128,60 128,60.08 | 128,60.08 v128,62 | 128,60.08 v128.05,60.7
  Bottom 0.254: v9,25.5 7.24,25.12 | v126,49.75 124.8,49.75
  Bottom 0.406: 8.5,54.42 RSENSE1.1 | v130.4,86.8 130.62,84.38 130.62,81.5 | 10.74,77.6 9.28,76.14 | 9.28,76.14 9.07,75.94 | D5.A 9.28,76.14 | D1.A 131.4,61.59 130.8,62.19 130,61.39 129.36,61.39 | D2.A 130.85,8.9 130.75,9
  Bottom 0.61: C35.2 7.25,23.25 7.75,22.75 | RSENSE1.1 12.12,55.38 15.25,52.25 32.5,52.25 v32.5,50.8
  Bottom 0.813: 129.5,7.75 C26.2
  Bottom 1.27: C8.2 10.74,77.6 | 129.36,61.39 128.3,60.33 v128.05,60.7 C17.2 | 121,9.38 123.38,9.38 v121,8.75 | 121,9.38 v121,10.5 121,10.75 | 121,9.38 v121,8.75 | v121,8.75 121.5,6.75 125,6.75 125.5,7.5 125.5,9.25
  Bottom 1.93: 129.5,7.75 129.5,9 | 127.75,26.88 125.8,26.88 125.8,27.5
  Bottom 2.184: 128,9 128,12.12
  Bottom 2.54: RSENSE2.1 130.5,81.62 130.62,81.5 130.75,81.38 | 130.75,75.8 C41.-
  Bottom 3.81: RSENSE1.1 9.07,55.62 C2.- C7.- 9.07,75.94 | 130.75,81.38 130.75,75.8 | C41.- C16.- 130.8,62.19 | 8.5,54.42 8.25,54.42 | 8.25,54.42 7.75,54.42 | 7.75,18.5 7.75,22.75 7.24,25.12 7,26.25 v7,25.5 8.25,25.5 | 7.75,18.5 7.75,12 C34.- 8.7,9.75 C50.- 14.3,10.75 v17.5,10.75 v20,10.75 v22.25,10.75 | D3.A 8.11,19.11 7.75,18.5 | 23,10.75 v22.25,10.75 | RSENSE3.1 v22.25,10.75 | 8.25,54.42 8.5,54.17 7.25,52.92 v7.25,41 v7.25,38.5 7.25,37.5 | 125.8,27.25 125.8,27.5 RSENSE4.1 v124.8,39.62 124.8,49.75 124.8,50.25 v124.75,50.38 | v124.75,47.75 v124.75,49.12 | v128,62 v128,59.38 | v128.05,60.7 128.05,60.33 128.3,60.33 | C25.- 127.75,25.25 127.75,25.62 | C42.- 127.75,17.75 127.75,18 | 130.75,9 129.5,9 128,9 128,9.25 125.5,9.25 123.38,9.25 | 122.5,9.25 123.38,9.25 | 123.38,9.25 123.38,7.88
  Bottom 6.452: 128,12.12 127.75,12.12 127.75,18 127.75,25.62 127.75,26.88
AREF
  Top 0.254: C33.2 66.3,54.65 65.75,53.6 65.75,52.75 U2.62
AVCC
  Top 0.254: 62.65,52.7 64.1,52.7 U2.64 | 62.65,55.85 C40.2 62.75,55.9 63.7,56.85 65.8,56.85 66.75,57.8 R97.1
  Top 0.406: 62.65,52.7 62.65,55.85
BREN  (via drill 0.38)
  Top 0.254: 60.9,29.7 R88.2 60.95,30.55 | 62.35,22.6 62.25,22.6 | R85.2 75.8,19.05 | R82.2 80.75,65.6 79.4,65.6 v79.4,65.5 | v78.2,36.4 73.75,36.4 73.75,37.5 U2.29 | 62.45,33.65 v62.15,33.45 | v78.25,33.25 77.85,33.65
  Top 0.406: 60.9,29.7 62.25,28.35 62.25,22.6 | 62.35,22.6 64.2,20.65 73.45,20.65 75,19.1 75.75,19.1 R85.2 | 79.4,65.6 76.85,67.4 v65.1,67.45 | v62.95,69.6 60.7,71.75 R79.2 | v62.05,31.75 60.95,30.55 | 77.85,33.65 62.45,33.65
  Bottom 0.254: v79.4,65.5 79.75,65.15 79.75,37.95 v78.2,36.4 78.25,36.3 v78.25,33.25 | v62.05,31.75 62.15,31.85 v62.15,33.45
  Bottom 0.406: v62.95,69.6 64.5,69.6 65.1,69 v65.1,67.45
CP1
  Top 0.305: U$4.CP1 49.38,59.87 49.62,59.5 49.62,57.4 C3.1
CP2
  Top 0.305: U$4.CP2 48.67,57.93 C3.2
DIR1  (via drill 0.38)
  Top 0.254: 70.5,37.55 U2.25
  Top 0.406: v64.65,62.75 R78.2 | v64.7,43 68.8,44 70.45,42.4 70.5,39.05 70.5,37.55
  Bottom 0.254: v64.65,62.75 64.65,50.1 64.9,49.85 64.8,42.9 v64.7,43
DIR2  (via drill 0.38)
  Top 0.254: R81.2 80.55,66.45 v80.25,66.45 | 71.35,36.2 71.35,37.5 U2.26
  Top 0.406: v80.25,37.25 78.55,35.55 72.6,35.55 71.35,36.2
  Bottom 0.254: v80.25,37.25 v80.25,66.45
DIR3  (via drill 0.38)
  Top 0.254: R87.2 60.3,28.55 v59.95,29.05 | 72.1,39.1 72.1,37.55 U2.27
  Top 0.406: v59.65,35.5 61.15,36.4 v62.05,36.4 | v64.05,45.05 69.2,45 72.1,42.1 72.1,39.1
  Bottom 0.254: 60.05,29.25 v59.95,29.05 | v62.05,36.4 62.25,36.7 62.25,39.05 63.95,41.65 63.95,44.95 v64.05,45.05
  Bottom 0.406: 60.05,29.25 60.05,35.1 v59.65,35.5
DIR4  (via drill 0.38)
  Top 0.254: R84.2 76.1,22.5 v76.8,22.5 | 72.95,38.2 72.95,37.55 U2.28
  Top 0.406: v74.9,39 72.95,39 72.95,38.2
  Bottom 0.254: v76.8,22.5 75.7,23.6 75.7,38.2 v74.9,39
FAULT1  (via drill 0.38)
  Top 0.254: U$4.FAULT 48.7,63.85 48.85,64 53.8,64 54.05,64.25 55.7,64.25 56.4,63.55 R63.1 56.5,62.45 | v78.85,38.25 78.6,38.25 77.75,39.1 U2.33 | 78.55,61 v78.9,60.65
  Top 0.406: 78.55,61 58.35,61 56.5,62.45
  Bottom 0.254: v78.85,38.25 79.25,38.65 79.25,60.3 v78.9,60.65
FAULT2  (via drill 0.38)
  Top 0.254: 83.6,72.55 84.3,71.85 86.05,71.85 86.2,72 90.9,72 91.05,72.15 U$1.FAULT | R64.1 83.6,72.55 | 78.6,39.9 77.9,40.1 77.75,39.95 U2.34 | v81.1,71.6 82,72.5 83.5,72.5 83.6,72.55
  Top 0.406: v81.1,42.6 78.6,39.9
  Bottom 0.254: v81.1,42.6 80.75,42.95 80.75,65.75 81.1,66.1 v81.1,71.6
FAULT3  (via drill 0.38)
  Top 0.254: U$2.FAULT 52.2,23.75 52.3,23.65 58.2,23.65 59.4,22.45 R91.1 59.45,21.85 | 77.6,47.05 77.7,47.15 U2.43
  Top 0.406: v64.05,47.05 77.6,47.05 | v62.9,59 62.15,58.55 v59.4,58.55 | v59.35,55.95 56.4,52.9 54.45,52.9 v52.75,51.2 | 59.45,21.85 59.4,21.8 59.4,20.4 61.45,20.4 v61.75,20.7
  Bottom 0.254: v64.05,47.05 63,47.9 v62.9,59 | v59.4,58.55 59.35,58 v59.35,55.95
  Bottom 0.406: v52.75,51.2 52.75,32.15 60.45,24.35 60.6,24.2 63.1,24.2 63.1,20.7 v61.75,20.7
FAULT4  (via drill 0.38)
  Top 0.254: 86.45,24.45 86.55,24.45 U$3.FAULT | 79.1,25.95 R92.1 79,26.8 78.4,26.8 v77.95,27.25 | v77.05,32.8 76.85,32.6 | 64.9,37.55 U2.18
  Top 0.305: 64.9,38.6 63.55,38.6 62.2,37.25
  Top 0.406: 86.45,24.45 80.5,24.45 80.45,24.5 79.1,24.5 79.1,25.95 | 64.9,38.6 64.9,37.55 | v58.95,37.25 62.2,37.25 | v59.2,31.65 60.55,32.6 76.85,32.6
  Bottom 0.254: v77.05,32.8 77.95,31.9 v77.95,27.25
  Bottom 0.406: v58.95,37.25 58.4,36.6 58.4,32.25 v59.2,31.65
GLED1  (via drill 0.38)
  Top 0.254: 76.95,40.75 77.7,40.75 U2.35
  Top 0.406: v74.9,88.2 R1.2 | v78.4,82.1 v74.9,85.6 | 76.95,40.75 v76.05,41.55
  Bottom 0.254: 78.4,61.35 78.05,61 78.05,60.15 78.75,59.45 78.75,44.05 v76.05,41.55
  Bottom 0.406: v74.9,85.6 v74.9,88.2 | 78.4,61.35 v78.4,82.1
GLED2  (via drill 0.38)
  Top 0.254: 77.75,41.55 U2.36
  Top 0.406: R99.2 68.4,88.7 73,88.7 v81.95,79.75 | v81.6,44.3 78.85,41.55 77.75,41.55
  Bottom 0.254: v81.95,79.75 81.95,56.3 81.6,55.95 v81.6,44.3
GLED3  (via drill 0.38)
  Top 0.254: v79,88.65 R101.2 | 78.55,42.35 77.75,42.35 U2.37
  Top 0.406: 78.55,42.35 v83.3,47.2
  Bottom 0.254: 87.95,87.75 89.75,87.75 89.75,84 82.7,76.95 82.7,56.55 83.3,55.95 v83.3,47.2
  Bottom 0.406: v79,88.65 82.05,85.6 85.8,85.6 87.95,87.75
GLED4  (via drill 0.38)
  Top 0.254: 77.05,43.15 77.7,43.15 U2.38
  Top 0.406: R103.2 62.7,88.4 62.7,76.3 67.25,76.3 70.1,79.05 v77.25,79.05 | 77.05,43.15 v76.05,43.45
  Bottom 0.254: 77.25,60 78.25,59.3 78.25,45.95 v76.05,43.45
  Bottom 0.406: 77.25,60 v77.25,79.05
GND  (via drill 0.38, 0.38 pad 0.51, 0.51, 0.6)
  Top 0.254: 109.55,89.5 JP1.10 109.45,90.1 | 112.05,89.5 JP1.8 | 133.95,66.95 MOTOR2.5 | 129.9,37.05 QUAD4.3 | 135.95,34.1 136.25,34 | 129.85,48.05 QUAD2.3 | 27.1,77.8 U$5.3 | 47.75,77.8 47.9,77.65 S1.B2 | 62.35,57.4 62.6,57.65 C40.1 | 56.5,56.8 R5.2 | 65.1,54.55 65.1,52.75 64.95,52.75 U2.63 | 65.1,54.55 C33.1 | 13.15,34.95 QUAD3.3 | 68.1,37.5 U2.22 | v65.55,54.85 65.1,54.55 | 62.8,57.75 62.75,57.7 | v44.85,77.9 44.85,77.8 | 101,35.55 C53.1 | v66.3,17 67,17.12 | 26.85,96.1 LOGIC_HEADER.2
  Top 0.305: 45.97,60.53 45.75,60.75 v45.75,61.25 v45.75,63.5 U$4.PAD | U$4.GND 49.72,60.53 50.38,59.88 50.38,58.1 C4.2 | 43.62,56.38 41.77,56.38 C5.1 | OP1.2 37.88,52 37.5,51.62 35.65,51.62 C57.1 | C58.1 50.62,51.9 R94.1 | OP2.2 101.88,83 102.25,83.38 103.38,83.38 104.25,82.5 104.85,82.5 C56.1 | 93.78,75.47 94,75.25 | R18.2 C39.1 C13.2 88.85,79.03 90,77.88 90,75.75 90.25,75.5 91.05,75.5 U$1.GND | U$2.GND 49.27,20.48 49.25,20.5 | C32.1 91.37,31.2 91.1,31.15 91,31.25 | 86.03,27.72 U$3.GND 86.61,27.75 89.5,27.75 | 85,31.75 84.1,31.75 C31.2 C15.1 R44.2 | OP4.2 97.75,36.25 98,36.45 99.85,36.45 C53.1 | 36,55.6 36,56 38.65,56 R76.2 | C66.1 96.75,81.2 96.75,79.5
  Top 0.406: 43.5,56.25 43.62,56.38 | COMP1.2 45.25,55.12 | 45.25,55.12 45.25,57.5 44.88,57.62 | R94.1 49,54.38 48.25,55.12 45.25,55.12 | C5.1 41.73,56.35 41.62,56.25 41.62,54.98 R76.2 37.88,54.1 OP1.2 | OP2.2 101.75,82.2 101.75,81.25 101.1,80.6 R83.2 98.72,80.12 C14.1 | C55.1 88.9,83.22 90.25,81.88 90.6,81.88 R80.1 92.15,81.6 92.75,81 94,81 94.38,81.38 | 94.38,81.38 94.38,82.2 COMP2.2 | 94.38,81.38 94.38,78.38 94.62,78.12 94.88,77.88 | OP4.2 97.75,33.65 R100.2 96.85,32.75 96.25,32.75 95.15,31.65 C32.1 | R96.1 86.75,33.5 85,31.75 | R96.1 86.15,34.1 85,35.25 C54.1 | R96.1 89.35,34.1 89.88,34.62 COMP4.2 | U$7.3 80.88,10.12 73.88,17.12 | R31.2 59.3,17.05 59.38,17.12 | 112.05,89.5 109.55,89.5 | v126.2,66.95 133.95,66.95 | 129.9,37.05 132.85,34.1 135.95,34.1 | U$6.3 122,49 122,45.4 127.4,45.4 129.85,48.05 | 47.75,77.8 44.85,77.8 | U$8.3 28.8,35.4 13.3,35.4 13.15,34.95 | 68.1,37.5 68.1,36.05 v67.7,36.05 | 101,35.55 104,38.55 128.3,38.55 129.75,37.1 QUAD4.3 | 83.62,90.1 109.45,90.1 | U2.53 72.92,50.92 72.5,50.5 v66.5,50.5 | C65.1 36,55.6 | 24,96.87 LOGIC_HEADER.1 | C67.1 29.25,12.7 C51.1 | C68.1 93.1,32.93 91.37,31.2
  Top 0.61: C51.1 29.6,11.5 31.25,11.5 31.75,12 OP3.2 31.75,13.6 R111.2 33,14.5 33.2,14.7 39.5,14.7 | 39.5,14.7 44.4,14.7 | 44.4,14.7 44.65,14.7 | 44.65,14.7 46.75,14.7 C52.1 | R104.1 44.4,14.7 | COMP3.2 39.5,14.7 | MOTOR3.5 3.75,12 2,13.75 | MOTOR1.5 2.25,69 | C23.1 44.5,14.65 44.65,14.7 | MOTOR4.5 136.25,10 136.25,34 | 67,17.12 73.88,17.12 | U$5.3 27,78.1 v27,83.5 | v27,88 28.25,89.25 31.75,89.25
  Top 0.813: R5.2 C6.1 C4.2 | 97.65,79.75 C14.1 | R31.2 C24.1 C22.2 | 59.38,17.12 67,17.12 | R18.2 88.97,79.03 | R44.2 74.15,31.65 v66.7,25.3 | 62.35,57.4 59.25,57.4 58.65,56.8 56.5,56.8 | v65.8,59 62.8,57.75 | 62.75,57.7 C40.1 | C59.2 43,88 | C64.2 46,88 | C60.2 37,88 | C63.2 34,88.5 33.5,88
  Top 1.016: 94.88,77.88 95.12,77.88 96.75,79.5 97.4,79.5 97.65,79.75 | 2,13.75 2,45.25 | QUAD1.3 12.83,45.42 5.75,45.5 2.25,45.5 2,45.25 | 2.25,69 2,69 2,45.25 | 46.75,14.7 48.5,16.25 49.25,15.5 54.25,15.5 54.75,16 C22.2 | 91,31.25 89.12,33.12 89.12,33.75 86.88,33.75 85,31.88 85,31.75 84.9,31.65 R44.2 | 88.97,79.03 89,79 | 92,81 92.5,81 93,80.5 94,80.5 94,78.75 94.62,78.12 | R18.2 83.62,90.1 83.62,92.88 LED13.C
  Top 1.27: 45.97,60.53 45.97,58.72 44.88,57.62 43.62,56.38 | U$1.PAD v94,74.5 94,75.25 94,77 94.88,77.88 | LED13.C LED9.C LED11.C 64.5,97.2 | 64.5,97.2 64,97 v64,79 | LED15.C 64.5,97.2 | v45.75,65.75 v45.75,63.5 | 21.12,96.87 24,96.87
  Top 1.422: 2.25,69.25 2,69
  Top 1.676: 21.12,96.87 2.25,78 2.25,69.25 | U$2.PAD v49.25,21.5 49.25,20.5 49.25,17 48.5,16.25 | U$3.PAD v89.5,27 89.5,27.75 89.5,29.75 91,31.25 | 89,79 89,81 92,81 | LOGIC_HEADER.1 26.29,97.13 LOGIC_HEADER.2
  Top 1.93: 45.97,60.53 45.97,55.03 46,55 47.5,55 48.5,54 52,54 52.25,53.75 52.25,56.23 C4.2
  Top 2.184: LOGIC_HEADER.2 26.67,97 29,97 31.6,94.4 C62.2 31.6,89.4 31.75,89.25 33,88 33.5,88 37,88 40,88 | 46,88 43,88 40,88 | 40,88 40,88.5 39.5,89 39.5,92.9 C61.2
  Bottom 0.254: 126.15,67 v126.2,66.95 | 117.2,89.45 JP1.4 117.05,89.5 | 114.65,89.5 JP1.6 114.5,89.5 | 112.1,89.5 JP1.8 | QUAD4.3 129.9,37.1 131.4,38.6 131.4,46.55 129.9,48.05 QUAD2.3 | v67.7,36.05 66.63,35.93 | v65.55,54.85 66.52,54.51 | v65.8,59 66.63,57.71 | v44.85,77.9 45,79 | 26.55,96.9 26.3,96.65 | 26.3,96.65 26,96.33 | 26.3,96.65 LOGIC_HEADER.2
  Bottom 0.406: 126.15,67 126.15,82.05 126.7,82.6 126.7,83.4 122.4,87.7 117.2,87.7 117.2,89.45 | 117.05,89.5 114.65,89.5 | 114.5,89.5 112.1,89.5 | C46.2 66.5,46.25 | C45.2 66.41,45.65 | 66.7,19.5 67,19.8 C71.2 C69.2
  Bottom 0.61: v27,83.5 v27,88
  Bottom 1.016: QUAD1.3 12.42,45.42 10.5,43.5 10.5,36 12,34.5 12.46,34.5 QUAD3.3
  Bottom 1.27: LOGIC_HEADER.4 LOGIC_HEADER.3 LOGIC_HEADER.2
  Bottom 1.422: C70.1 66.3,15.8 | C72.1 66.5,17.7 66.42,17.78
  Bottom 2.184: 66.3,15.8 v66.3,17 66.42,17.78 66.7,19.5 v66.7,25.3 66.63,35.93 66.41,45.65 66.5,46 66.5,46.25 v66.5,50.5 66.5,54 66.52,54.51 66.63,57.71 67,68.5 67,79 v64,79 45,79 30,94 30,96.21 LOGIC_HEADER.3
  other vias: 94,72.5 89.5,24.75
  pour Top: 21,99 1,79 1,1 139,1 139,79 119,99
LIM1  (via drill 0.38)
  Top 0.305: R77.2 54.5,65.75 54,65.25 53,65.25 52.25,64.5 U$4.ENABLE | LIM1.P$1 40.8,48.38 v40.5,48.4 | v43.6,46.2 45,46.2 R114.1
  Top 0.406: v56.12,67.12 56.88,66.38 56.88,65.78 R77.2 | v45.2,50.1 44.33,50.1 COMP1.4
  Top 0.61: COMP1.4 44.3,50.05 LIM1.P$1
  Bottom 0.406: v56.12,67.12 56.02,56.25 56,56.25 56,54.5 44.3,54.6 44.3,51.4 44.5,51.4 45.2,50.7 v45.2,50.1 | v40.5,48.4 40.8,46.3 v43.6,46.2
LIM2  (via drill 0.38)
  Top 0.305: U$1.ENABLE 87.38,71.5 87,71.12 84.5,71.12 83.62,70.25 R57.2 83.15,69.35 v83.5,68.85 | v95.38,86.5 95.38,86 95.38,85 COMP2.4 | R115.1 85,87.8 v91.7,87.8
  Top 0.406: LIM2.P$1 95.38,86
  Bottom 0.305: v83.5,68.85 83.5,72.25 95.38,84.12 v95.38,86.5 | v91.7,87.8 95.38,87.8 LIM2.P$1
LIM3  (via drill 0.38)
  Top 0.305: U$2.ENABLE 58.6,24.45 58.67,24.52 | 58.67,24.52 R59.2 | LIM3.P$1 60.5,22.7 58.67,24.52 | COMP3.4 38.9,10.45 v39.5,9.9
  Top 0.406: COMP3.4 38.5,10.45 38.5,11.6 R116.1
  Bottom 0.305: v39.5,9.9 48.2,9.9 LIM3.P$1
LIM4  (via drill 0.38)
  Top 0.305: U$3.ENABLE | R58.2 77.62,24.02 LIM4.P$1
  Top 0.406: R58.2 U$3.ENABLE | COMP4.4 90.83,39.33 v91,39.5 89.8,39.5 89.8,41.7 R117.1
  Bottom 0.406: v91,39.5 91,38.88 LIM4.P$1
M1H1  (via drill 0.38)
  Top 0.305: U$4.HA 48.69,66.5 50.5,66.5 v50.75,66.75 51.85,67.85 R106.1
  Top 0.406: MOTOR1.3 15,71 19.25,75.25 41.25,75.25 v44.75,71.75
  Bottom 0.305: v44.75,71.75 45.75,71.75 v50.75,66.75
M1H2
  Top 0.305: 48.11,67.14 U$4.HB 48.78,67.25 49.5,67.25 50.25,68 R107.1
  Top 0.406: MOTOR1.4 15,70 19.5,74.5 40.75,74.5 48.11,67.14
M1H3
  Top 0.305: U$4.HC 48.5,67.97 48.5,69.5 47.38,70.62 47.75,71 R105.1
  Top 0.406: MOTOR1.2 15,72 19,76 42,76 47.38,70.62
M1O1  (via drill 0.51)
  Top 0.254: MOTOR1.11 6,63.5 MOTOR1.10
  Top 0.305: C9.2 39.12,60.12 39.12,60.6 41.5,60.6 41.75,60.5 42.5,60.5 U$4.SA | v18,63.5 17,63.5 16.75,63.75
  Top 0.406: v20,63.5 29,63.5 30.75,62 37.88,62 39.12,60.6 | MOTOR1.11 12.5,63 M1O1.P$1
  Top 1.676: 6,63.5 M1O1.P$1 v18,63.5 v20,63.5
  Bottom 1.27: R7.2 18.1,70.15 18,70.25
  Bottom 1.676: v18,63.5 v20,63.5 | M1O1.P$1 16.24,63.5 arc45 16.69,63.69 Q3.DRAIN
  Bottom 2.184: Q6.SOURCE 18,71.25 18,70.25 Q3.DRAIN
M1O2  (via drill 0.51)
  Top 0.254: MOTOR1.9 6,65.5 MOTOR1.8
  Top 0.305: C10.2 39.75,63.9 41,63.9 41.5,63.25 42.5,63.25 U$4.SB
  Top 0.406: v28,65.5 28.25,65.25 31,63 C10.2 | MOTOR1.9 12.5,65 M1O2.P$1
  Top 1.676: 6,65.5 M1O2.P$1 v26,65.5 v28,65.5
  Bottom 1.27: R9.2 25.88,70.1 25.75,70.22
  Bottom 1.676: Q4.DRAIN 25.84,65.16 arc-45 v26,65.5 M1O2.P$1 | 25.7,65 27.24,65 arc45 27.69,65.19 v28,65.5
  Bottom 2.184: Q4.DRAIN 25.7,65 | v26,65.5 25.75,70.22 Q1.SOURCE
M1O3  (via drill 0.51)
  Top 0.254: MOTOR1.7 6,67.5 MOTOR1.6
  Top 0.305: C11.2 39.75,67 41,67 41.25,66.75 41.25,65.75 42.5,65.75 U$4.SC
  Top 0.406: v36,67.5 37.5,67.5 38.25,66.75 C11.2 | MOTOR1.7 12.5,67 M1O3.P$1
  Top 1.676: 6,67.5 M1O3.P$1 v34,67.5 v36,67.5
  Bottom 1.27: R11.2 33.75,70.5 33.7,70.55
  Bottom 1.676: v34,67.5 33.7,67.5 | M1O3.P$1 v36,67.5
  Bottom 2.184: Q5.DRAIN 33.7,65 33.7,67.5 33.7,70.55 Q2.SOURCE
M1QA  (via drill 0.38)
  Top 0.254: 62.55,50.35 62.5,50.3 U2.2 | 12.9,48.45 QUAD1.2
  Top 0.406: 62.55,50.35 53.15,50.35 51.45,48.65 v50.4,48.55 | v45.3,48.95 43,46.95 14.2,46.95 12.9,48.45
  Bottom 0.254: v50.4,48.55 45.1,48.55 v45.3,48.95
M1QB  (via drill 0.38)
  Top 0.254: 62.45,49.45 62.5,49.5 U2.3 | 12.9,43.4 QUAD1.4
  Top 0.406: v54.3,46 51.4,43.4 12.9,43.4 | v55.9,47.9 61.1,47.9 61.1,49.4 62.51,49.4 U2.3
  Bottom 0.254: v54.3,46 v55.9,47.9
M2H1  (via drill 0.38)
  Top 0.305: R66.1 88.75,69.52 U$1.HA 88.77,69.52 v88.5,69.25
  Top 0.406: 95.25,65 v95.38,64.88 99.38,60.88 124,60.88 124.75,61.62 124.75,63.25 126.88,65.38 129.25,65.38 129.62,65 MOTOR2.3
  Bottom 0.305: v88.5,69.25 91,69.25 95.25,65
  Bottom 0.406: 95.25,65 v95.38,64.88
M2H2
  Top 0.305: R67.1 89.88,68.25 90.49,68.86 U$1.HB 91.51,68.86 92.38,68 94,68 100.12,61.88
  Top 0.406: 100.12,61.88 124,61.88 124,63.5 126.62,66.12 133.88,66.12 MOTOR2.4
M2H3
  Top 0.305: U$1.HC 91.3,68.2 91.38,68.12 91.38,66 92.38,65 92.38,64.03 | 92.38,64.03 R65.1 | 92.38,64.03 94.22,64.03 98.38,59.88
  Top 0.406: 98.38,59.88 124.12,59.88 125.5,61.25 125.5,63 127,64.5 129,64.5 129.5,64 MOTOR2.2 133.88,64.12
M2O1  (via drill 0.51)
  Top 0.254: MOTOR2.11 134,72.5 MOTOR2.10
  Top 0.305: U$1.SA 98.16,75.47 98.38,75.25 99.9,75.25
  Top 0.406: 99.9,75.25 C18.2 100.9,75.35 102.25,74 118.25,74 v119.75,72.5
  Top 1.676: 134,72.5 M2O1.P$1 v122,72.5 v119.75,72.5
  Bottom 1.016: R20.2 122.1,65.45 Q9.SOURCE
  Bottom 1.676: 123.5,72.5 v122,72.5 v119.75,72.5 | 124.25,72.5 123.5,72.5 | 123.5,72.5 Q12.DRAIN
  Bottom 2.184: Q9.SOURCE 122,64.75 Q12.DRAIN
M2O2  (via drill 0.51)
  Top 0.305: MOTOR2.8 134,70.5 MOTOR2.9 | U$1.SB 98.17,72.83 99,72 100.4,72 C19.2
  Top 0.406: C19.2 109.25,73 v111.75,70.5
  Top 1.676: 134,70.5 M2O2.P$1 v114,70.5 v111.75,70.5
  Bottom 1.016: 114.05,65.55 R22.2
  Bottom 1.676: 114.05,65.55 114.05,65 Q10.SOURCE | Q13.DRAIN 114,72.75 | v111.75,70.5 112.5,70.5 | 112.5,70.5 v114,70.5 112.75,71.75 112.5,71.75 112.5,70.5
  Bottom 2.184: Q13.DRAIN v114,70.5 114.05,65.55
M2O3  (via drill 0.51)
  Top 0.254: MOTOR2.7 134,68.5 MOTOR2.6
  Top 0.305: 101.4,69.97 C20.2 100.4,69 99,69 98.75,69.25 98.75,70 98.57,70.18 U$1.SC | 102.88,68.5 v103.75,68.5
  Top 0.406: 101.4,69.97 102.88,68.5
  Top 1.676: 134,68.5 M2O3.P$1 v106,68.5 v103.75,68.5
  Bottom 1.016: R24.2 106,65.4 106.05,65 Q11.SOURCE
  Bottom 1.676: 107.5,68.5 v106,68.5 v103.75,68.5 | 108.25,68.5 107.5,68.5 | 107.5,68.5 106,70
  Bottom 2.184: Q14.DRAIN 106,70 v106,68.5 106,65.4
M2QA  (via drill 0.38)
  Top 0.254: v64,49.55 63.25,48.7 62.7,48.7 62.55,48.75 U2.4 | 83.7,64.05 86.4,66.75 86.4,67.1 v88.7,67.1 | 128.4,44.5 130.1,45.5 QUAD2.2
  Top 0.406: v65.2,66.25 67.3,64.05 83.7,64.05 | 128.4,44.5 v105.6,44.5
  Bottom 0.254: 63.8,49.75 v64,49.55 | v105.6,44.5 v88.7,67.1
  Bottom 0.406: 63.8,49.75 63.8,64.75 v65.2,66.25
M2QB  (via drill 0.38)
  Top 0.254: 62.7,48 62.55,47.95 U2.5
  Top 0.406: 62.7,48 73.25,48 77.1,52.15 v118.15,51.75
  Bottom 0.254: v118.15,51.75 122.95,51.75 123.85,52.65 130.1,52.65 130.1,50.65 QUAD2.4
M3H1  (via drill 0.38)
  Top 0.305: R72.1 54.38,26.43 U$2.HA 54.08,26.43 54.1,26.45 v54.1,27.45
  Top 0.406: 8.75,14.5 10,15.75 10,22.75 19.75,33.2 47.55,33.2 v48,32.75
  Top 0.61: MOTOR3.3 8.25,14 8.75,14.5
  Bottom 0.305: v54.1,27.45 53.3,27.45 v48,32.75
M3H2
  Top 0.305: R73.1 53.7,30.25 53.7,28.2 52.59,27.09 U$2.HB 52.16,27.1 51.1,27.1
  Top 0.406: 9.75,14.25 10.75,15.25 10.75,22.5 20,32.45 41.75,32.45 42.75,31.45 46.75,31.45 51.1,27.1
  Top 0.61: MOTOR3.4 8.5,13 9.75,14.25
M3H3
  Top 0.305: 41.25,33.95 49.85,33.95 R71.1
  Top 0.406: 41.25,33.95 19.5,33.95 9.25,23 9.25,16.5 7.75,15 | U$2.HC 52.17,31.63 R71.1
  Top 0.61: MOTOR3.2 7.75,15
M3O1  (via drill 0.38)
  Top 0.254: MOTOR3.11 MOTOR3.10 | M3O1.P$1 19.2,21.7
  Top 0.305: U$2.SA 45.17,20.48 44.75,20.95 43.3,20.95 C27.2
  Top 0.406: MOTOR3.11 7,6 7.5,6.5
  Top 0.61: C27.2 41.5,19.95 39.75,21.7 v23.5,21.7
  Top 1.676: 7.5,6.5 9.75,6.5 16.25,12.75 16.25,19.95 18,21.7 19.2,21.7 v21.25,21.7 v23.5,21.7 23.75,21.7
  Bottom 0.61: v21.25,21.7 Q20.DRAIN | 21.25,29.7 21.25,29.2 21.37,28.81 21.45,28.55
  Bottom 1.27: R33.2 21.51,29 | 21.51,29 21.36,28.85 | 21.25,29.7 21.2,29.7 Q17.SOURCE | 21.51,29 21.51,28.95 21.37,28.81
  Bottom 2.54: 21.45,28.55 21.45,25.8 21.25,26.2 Q20.DRAIN
M3O2  (via drill 0.38)
  Top 0.254: MOTOR3.9 MOTOR3.8
  Top 0.305: U$2.SB 45.66,23.12 45.39,23.4 42.95,23.4 C28.2
  Top 0.406: MOTOR3.9 7,8 7.5,8.5
  Top 0.61: C28.2 40.55,23.9 32,23.95
  Top 1.676: 7.5,8.5 9,8.5 14.25,13.75 14.25,20.75 17.45,23.95 M3O2.P$1 v29.25,23.95 v31.5,23.95 32,23.95
  Bottom 0.61: v29.25,23.95 Q21.DRAIN | 29.45,28.4 29.31,28.84 Q18.SOURCE
  Bottom 1.27: R35.2 29.47,29 29.31,28.84
  Bottom 2.54: v29.25,23.95 29.5,24.2 29.45,28.4
M3O3  (via drill 0.38)
  Top 0.254: MOTOR3.6 6,10.5 | M3O3.P$1 35.35,26.2
  Top 0.305: 41.6,26.2 C29.2 42.25,26.35 42.55,26.35 43.05,26.95 44.2,26.95 45.33,25.77 U$2.SC
  Top 0.406: MOTOR3.7 7,10 7.5,10.5
  Top 0.61: 40,26.2 41.6,26.2
  Top 1.676: 5.5,10.5 6,10.5 7.5,10.5 8,10.5 12.25,14.75 12.25,22 16.45,26.2 35.35,26.2 v37.25,26.2 v39.5,26.2 40,26.2
  Bottom 0.61: v37.25,26.2 Q22.DRAIN | Q19.SOURCE 37.2,29.7 37.41,28.82 37.45,28.65
  Bottom 1.27: R37.2 37.59,29 37.41,28.82
  Bottom 2.54: v37.25,26.2 37.5,26.45 37.45,28.65
M3QA  (via drill 0.38)
  Top 0.254: 62.25,47.15 62.5,47.1 U2.6
  Top 0.406: v21.15,45.05 49.1,45.05 50.3,47.15 53.75,47.15 54,47.4 54.8,47.4 55.3,46.9 57.1,46.9 57.3,47.1 62.2,47.1 62.25,47.15
  Bottom 0.254: 12.9,37.5 QUAD3.2
  Bottom 0.406: v21.15,45.05 14.5,37.5 12.9,37.5
M3QB
  Top 0.254: 62.45,46.25 62.5,46.3 U2.7 | 12.9,32.4 QUAD3.4
  Top 0.406: 62.45,46.25 56.1,46.25 51.7,42.05 34.35,42.05 31.2,38.5 31.2,34.7 15,34.7 12.9,32.4
M4H1  (via drill 0.38)
  Top 0.305: R69.1 82.5,20.75 83.52,21.77 U$3.HA 84.52,21.77 v83.75,21 | v91.25,15.75 93.5,13.62 127.5,13.62 127.5,8 MOTOR4.3
  Bottom 0.305: v83.75,21 86,21 v91.25,15.75
M4H2
  Top 0.305: R70.1 85.5,20.75 85.86,21.11 U$3.HB 87.39,21.11 89.25,19.25 90.25,19.25 95.25,14.25 128.12,14.25 128.12,9 MOTOR4.4
M4H3
  Top 0.305: U$3.HC 86.58,19.67 88.5,17.75 R68.1 90.35,15.15 92.62,13 126.75,13 126.88,7 MOTOR4.2
M4O1  (via drill 0.51)
  Top 0.305: C36.2 96.9,27.35 97,27.25 | 115.25,25.75 115.75,25.25 | U$3.SA 93.53,27.72 94.5,26.75 96.5,26.75 97,27.25 | 98.5,25.75 97,27.25 | MOTOR4.10 133.8,15.5 MOTOR4.11
  Top 0.61: 98.5,25.75 115.25,25.75
  Top 1.676: 115.75,25.25 v116,25.25 v120.5,25.25 133.8,25.25 133.8,15.5
  Bottom 0.406: M4O1.P$1 Q28.DRAIN
  Bottom 1.27: R46.2 118.45,17.9 118.5,17.95 118.5,18.5 118.3,18.7 118.3,17.25 Q25.SOURCE
  Bottom 1.676: Q28.DRAIN v120.5,25.25
  Bottom 3.81: Q28.DRAIN 118.3,18.7
M4O2  (via drill 0.51)
  Top 0.305: U$3.SB 93.67,25.07 94.5,24.25 96,24.25 96,24.6 C37.2 | MOTOR4.9 134,13.5 MOTOR4.8
  Top 0.61: v107.75,23.25 106.25,24.75 97.65,24.75 C37.2
  Top 1.676: v107.75,23.25 v112.5,23.25 131.75,23.25 131.75,13.5 134,13.5
  Bottom 1.27: 110.4,17.9 R48.2 | 110.2,18.8 110.2,18.1 110.4,17.9 | 110.4,17.9 110.4,17.15 Q26.SOURCE
  Bottom 1.676: M4O2.P$1 v107.75,23.25
  Bottom 3.81: M4O2.P$1 110.2,18.8
M4O3  (via drill 0.51)
  Top 0.305: 99.25,21.75 v99.75,21.25 | U$3.SC 93.57,22.43 94.75,21.25 96.25,21.25 96.25,21.35 C38.2 | MOTOR4.7 134,11.5 MOTOR4.6
  Top 0.61: C38.2 99.25,21.75
  Top 1.676: v99.75,21.25 v104.5,21.25 129.5,21.25 129.5,11.5 134,11.5
  Bottom 1.27: 102.3,19.1 101.15,18 | R50.2 100.95,17.8 101.15,18 | 101.15,18 101.55,18 Q27.SOURCE
  Bottom 1.676: Q30.DRAIN 101.75,23.25 v99.75,21.25
  Bottom 3.81: Q30.DRAIN M4O3.P$1 102.3,19.1
M4QA  (via drill 0.38)
  Top 0.254: 63.7,45.9 63.3,45.5 62.5,45.5 62.55,45.55 U2.8 | 130.1,34.55 QUAD4.2
  Top 0.406: 63.7,45.9 69.5,45.9 77.8,37.4 79.2,37.4 82.5,40.5 85.4,43.4 97.4,43.4 v97.4,40.5 | v103,35 103.45,34.55 130.1,34.55
  Bottom 0.254: v103,35 v97.4,40.5
M4QB  (via drill 0.38)
  Top 0.254: v64,39.45 63.95,39.45 63.95,43.95 63.35,44.55 62.7,44.55 62.55,44.7 U2.9 | v79.45,21.55 79.45,21.3 | 109.9,40.45 v109.8,40.55 | 129.3,40.45 130.1,39.65 QUAD4.4
  Top 0.406: v64.95,21.85 74.3,21.9 74.3,21 75.2,20.1 78.65,20.1 79.45,21.3 | 129.3,40.45 109.9,40.45
  Bottom 0.254: v64,39.45 65.15,38.3 v64.95,21.85 | v79.45,21.55 79.8,21.9 79.8,25.7 86.4,32.4 102.3,32.4 102.9,33.65 v109.8,40.55
MISO  (via drill 0.38, 0.6)
  Top 0.254: 109.5,92 JP1.9 | 62.35,41.5 62.5,41.55 U2.13 | 59.65,75.25 v61.25,73.65 | 94.9,92.15 R3.1
  Top 0.406: R3.1 95.75,91.35 108.85,91.35 109.5,92 | 62.35,41.5 59.2,41.5 58.7,41 v56.6,41 | 59.65,75.25 59.65,98.5 85.6,98.5 91.05,93.05 93.9,93.05 94.9,92.15
  Bottom 0.254: 57.55,47.35 57.55,69.95 v61.25,73.65
  Bottom 0.406: 57.55,47.35 56.6,46.4 v56.6,41
MOSI  (via drill 0.38, 0.6)
  Top 0.254: 118.45,90.75 93.35,90.75 | 119.7,92 JP1.1 | 62.35,42.3 62.5,42.35 U2.12 | 91.9,92.15 R2.1
  Top 0.305: 60.55,42.3 62.35,42.3
  Top 0.406: 93.35,90.75 R2.1 | 119.7,92 118.45,90.75 | v86.05,96.45 90.85,92.15 91.9,92.15 | v62.55,73.85 61.85,74.55 v61.85,87.85 | v57.8,42.3 60.55,42.3
  Bottom 0.254: 58.15,46.8 58.05,69.25 62.15,73.35 v62.55,73.85
  Bottom 0.406: v61.85,87.85 70.45,96.45 v86.05,96.45 | 58.15,46.8 57.4,45.45 v57.8,42.3
N$1
  Top 0.254: LED9.A R1.1
N$2  (via drill 0.38)
  Top 0.305: C66.2 100.1,81.2 v100.04,81.3 | v103.83,81.67 102.83,81.8 OP2.3
  Top 0.406: R60.2 R83.1 102.83,80.2 OP2.3
  Bottom 0.305: v100.04,81.3 103.8,81.3 v103.83,81.67
N$3
  Top 0.406: R3.2 95,96.85 95.5,96.85 SPI_HEADER.2
N$4
  Top 0.254: 98,97.1 98.05,97.1 SPI_HEADER.3
  Top 0.406: 98,97.1 R4.2
N$5